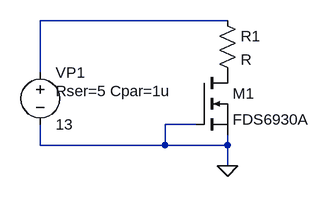
[diagram p0: schematic Draft1.asc]
Draft1.asc, the LTspice schematic file:
Version 4
SHEET 1 880 680
WIRE 224 48 -64 48
WIRE -64 128 -64 48
WIRE 176 208 128 208
WIRE -64 240 -64 208
WIRE 128 240 128 208
WIRE 128 240 -64 240
WIRE 224 240 224 224
WIRE 224 240 128 240
WIRE 224 272 224 240
FLAG 224 272 0
SYMBOL nmos 176 128 R0
SYMATTR InstName M1
SYMATTR Value FDS6930A
SYMBOL res 208 32 R0
SYMATTR InstName R1
SYMBOL voltage -64 112 R0
WINDOW 123 0 0 Left 0
WINDOW 39 24 44 Left 2
SYMATTR SpiceLine Rser=5 Cpar=1u
SYMATTR InstName VP1
SYMATTR Value 13

The netlist it stands for:
* Draft1.asc
M1 P001 0 0 0 FDS6930A
R1 N001 P001 R
VP1 N001 0 13 Rser=5 Cpar=1u
.model NMOS NMOS
.model PMOS PMOS
.lib standard.mos
.backanno
.end